# EAGLE schematic Base XIAO v7 (EAGLE 9.7.0)
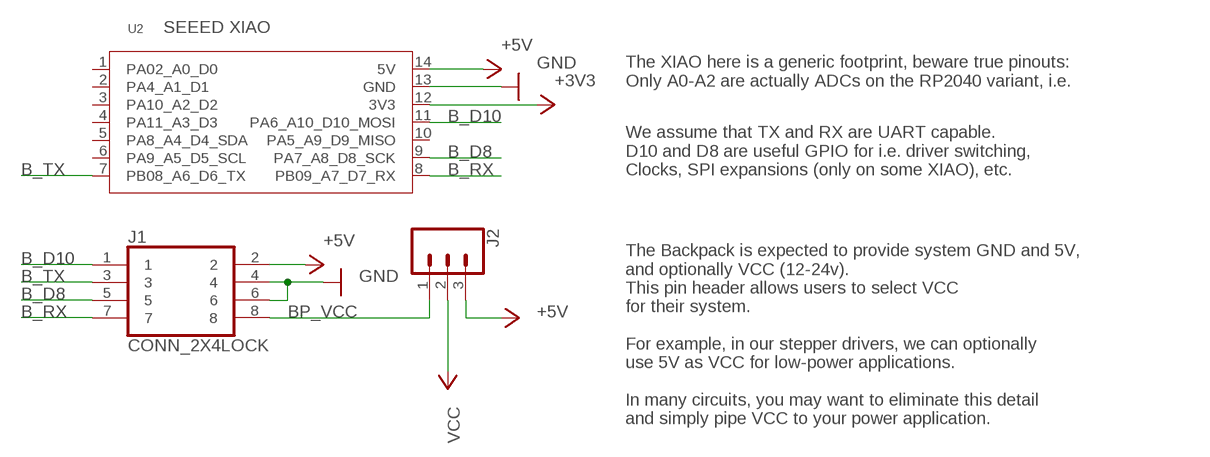
[diagram p0: schematic, sheet 1]

## Parts
J1  CONN_2X4LOCK  [2X4-LOCK]
J2  CONN_03LOCK_NO_SILK  [1X03_LOCK_NO_SILK]
U2  MOUDLE-SEEEDUINO-XIAO-DIP  [MOUDLE14P-2.54-21X17.8MM]

## Nets
+3V3: U2.12(3V3)
+5V: J1.2 J2.3 U2.14(5V)
B_D8: J1.5 U2.9(PA7_A8_D8_SCK)
B_D10: J1.1 U2.11(PA6_A10_D10_MOSI)
B_RX: J1.7 U2.8(PB09_A7_D7_RX)
B_TX: J1.3 U2.7(PB08_A6_D6_TX)
BP_VCC: J1.8 J2.1
GND: J1.4 J1.6 U2.13(GND)
VCC: J2.2
Unconnected: U2.1(PA02_A0_D0) U2.2(PA4_A1_D1) U2.3(PA10_A2_D2) U2.4(PA11_A3_D3) U2.5(PA8_A4_D4_SDA) U2.6(PA9_A5_D5_SCL) U2.10(PA5_A9_D9_MISO)

## Notes on the sheet
- SEEED XIAO
- The XIAO here is a generic footprint, beware true pinouts:
  Only A0-A2 are actually ADCs on the RP2040 variant, i.e.
- We assume that TX and RX are UART capable.
  D10 and D8 are useful GPIO for i.e. driver switching,
  Clocks, SPI expansions (only on some XIAO), etc.
- The Backpack is expected to provide system GND and 5V, 
  and optionally VCC (12-24v).
  This pin header allows users to select VCC 
  for their system.
  
  For example, in our stepper drivers, we can optionally 
  use 5V as VCC for low-power applications.
  
  In many circuits, you may want to eliminate this detail 
  and simply pipe VCC to your power application.

## Library data of the parts
J1 = jrr_connector:CONN_2X4
J2 = jrr_connector:CONN_03: Multi connection point. Often used as Generic Header-pin footprint for 0.1 inch spaced/style header connections On any of the 0.1 inch spaced packages, you can populate with these: Break Away Headers - Straight <https://www.sparkfun.com/products/116> (PRT-00116) Break Away Male Headers - Right Angle <https://www.sparkfun.com/products/553> (PRT-00553) Female Headers <https://www.sparkfun.com/products/115> (PRT-00115) Break Away Headers - Machine Pin <https://www.sparkfun.com/products/117> (PRT-00117) Break Away Female Headers - Swiss Machine Pin <https://www.sparkfun.com/products/743> (PRT-00743) Stackable Header - 3 Pin (Female, 0.1") <https://www.sparkfun.com/products/13875> (PRT-13875) For SCREWTERMINALS and SPRING TERMINALS visit here: Screw Terimnals on SparkFun.com <https://www.sparkfun.com/search/results?term=Screw+Terminals> (5mm/3.5mm/2.54mm spacing) This device is also useful as a general connection point to wire up your design to another part of your project. Our various solder wires solder well into these plated through hole pads. Hook-Up Wire - Assortment (Stranded, 22 AWG) <https://www.sparkfun.com/products/11375> (PRT-11375) Hook-Up Wire - Assortment (Solid Core, 22 AWG) <https://www.sparkfun.com/products/11367> (PRT-11367) View the entire wire category on our website here <https://www.sparkfun.com/categories/141> Special notes: Molex polarized connector foot print use with SKU : PRT-08232 with associated crimp pins and housings.
U2 = xiao:MOUDLE-SEEEDUINO-XIAO